# EAGLE schematic c (EAGLE 4.16)
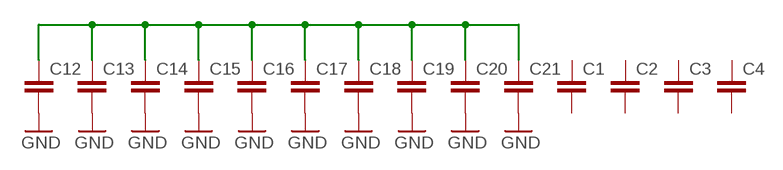
[diagram p0: schematic, sheet 1]

## Parts
C1  0.12UF1000V  [K78-2-1]
C2  0.12UF1000V  [K78-2-1]
C3  0.12UF1000V  [K78-2-1]
C4  0.12UF1000V  [K78-2-1]
C12  0.12UF1000V  [K78-2-1]
C13  0.12UF1000V  [K78-2-1]
C14  0.12UF1000V  [K78-2-1]
C15  0.12UF1000V  [K78-2-1]
C16  0.12UF1000V  [K78-2-1]
C17  0.12UF1000V  [K78-2-1]
C18  0.12UF1000V  [K78-2-1]
C19  0.12UF1000V  [K78-2-1]
C20  0.12UF1000V  [K78-2-1]
C21  0.12UF1000V  [K78-2-1]

## Nets
GND: C12.P$2 C13.P$2 C14.P$2 C15.P$2 C16.P$2 C17.P$2 C18.P$2 C19.P$2 C20.P$2 C21.P$2
N$16: C12.P$1 C13.P$1 C14.P$1 C15.P$1 C16.P$1 C17.P$1 C18.P$1 C19.P$1 C20.P$1 C21.P$1
Unconnected: C1.P$1 C1.P$2 C2.P$1 C2.P$2 C3.P$1 C3.P$2 C4.P$1 C4.P$2

## Library data of the parts
C1-C4 C12-C21 = den:0.12UF1000V